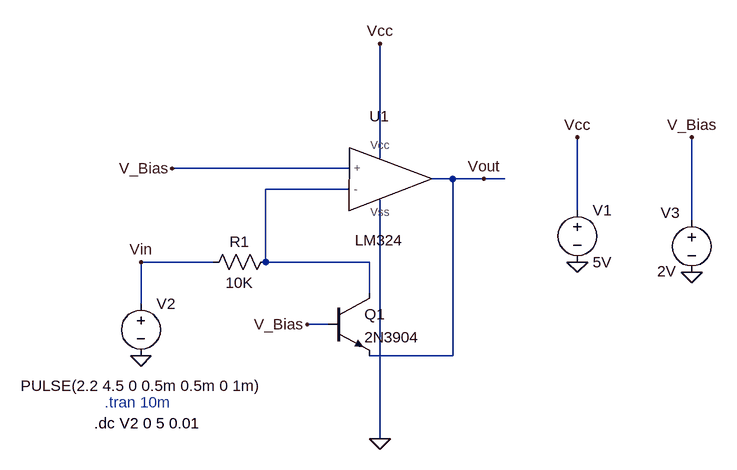
[diagram p0: schematic BAI 6 THUC HANH 3.asc]
BAI 6 THUC HANH 3.asc, the LTspice schematic file:
Version 4.1
SHEET 1 880 680
WIRE 208 112 208 -64
WIRE 160 128 -112 128
WIRE 320 144 288 144
WIRE 368 144 320 144
WIRE 400 144 368 144
WIRE 160 160 32 160
WIRE 512 192 512 80
WIRE 688 208 688 80
WIRE -48 272 -160 272
WIRE 32 272 32 160
WIRE 192 272 32 272
WIRE 192 320 192 272
WIRE -160 336 -160 272
WIRE 128 368 96 368
WIRE 320 416 320 144
WIRE 320 416 192 416
WIRE 208 544 208 176
FLAG 368 144 Vout
FLAG -160 416 0
FLAG 208 -64 Vcc
FLAG 512 272 0
FLAG 512 80 Vcc
FLAG -160 272 Vin
FLAG 208 544 0
FLAG 688 288 0
FLAG 688 80 V_Bias
FLAG -112 128 V_Bias
FLAG 96 368 V_Bias
SYMBOL LM324 208 144 R0
SYMATTR InstName U1
SYMBOL npn 128 320 R0
SYMATTR InstName Q1
SYMATTR Value 2N3904
SYMBOL res 48 256 R90
WINDOW 0 0 56 VBottom 2
WINDOW 3 32 56 VTop 2
SYMATTR InstName R1
SYMATTR Value 10K
SYMBOL voltage -160 320 R0
WINDOW 3 -185 142 Left 2
WINDOW 123 0 0 Left 0
WINDOW 39 0 0 Left 0
SYMATTR Value PULSE(2.2 4.5 0 0.5m 0.5m 0 1m)
SYMATTR InstName V2
SYMBOL voltage 512 176 R0
SYMATTR InstName V1
SYMATTR Value 5V
SYMBOL voltage 688 192 R0
WINDOW 0 -48 4 Left 2
WINDOW 3 -53 94 Left 2
SYMATTR InstName V3
SYMATTR Value 2V
TEXT -216 488 Left 2 ;.tran 10m
TEXT -232 520 Left 2 !.dc V2 0 5 0.01

The netlist it stands for:
* BAI 6 THUC HANH 3.asc
X§U1 V_Bias N001 Vcc 0 Vout LM324  ; pins + - Vcc Vss ?
Q1 N001 V_Bias Vout 0 2N3904
R1 N001 Vin 10K
V2 Vin 0 PULSE(2.2 4.5 0 0.5m 0.5m 0 1m)
V1 Vcc 0 5V
V3 V_Bias 0 2V
.model NPN NPN
.model PNP PNP
.lib standard.bjt
* .tran 10m
.dc V2 0 5 0.01
.lib E:\ThiThucHanhCoHa\CoHa\LM324.cir
.backanno
.end